# EAGLE design H_Power_feed (EAGLE 6.3)
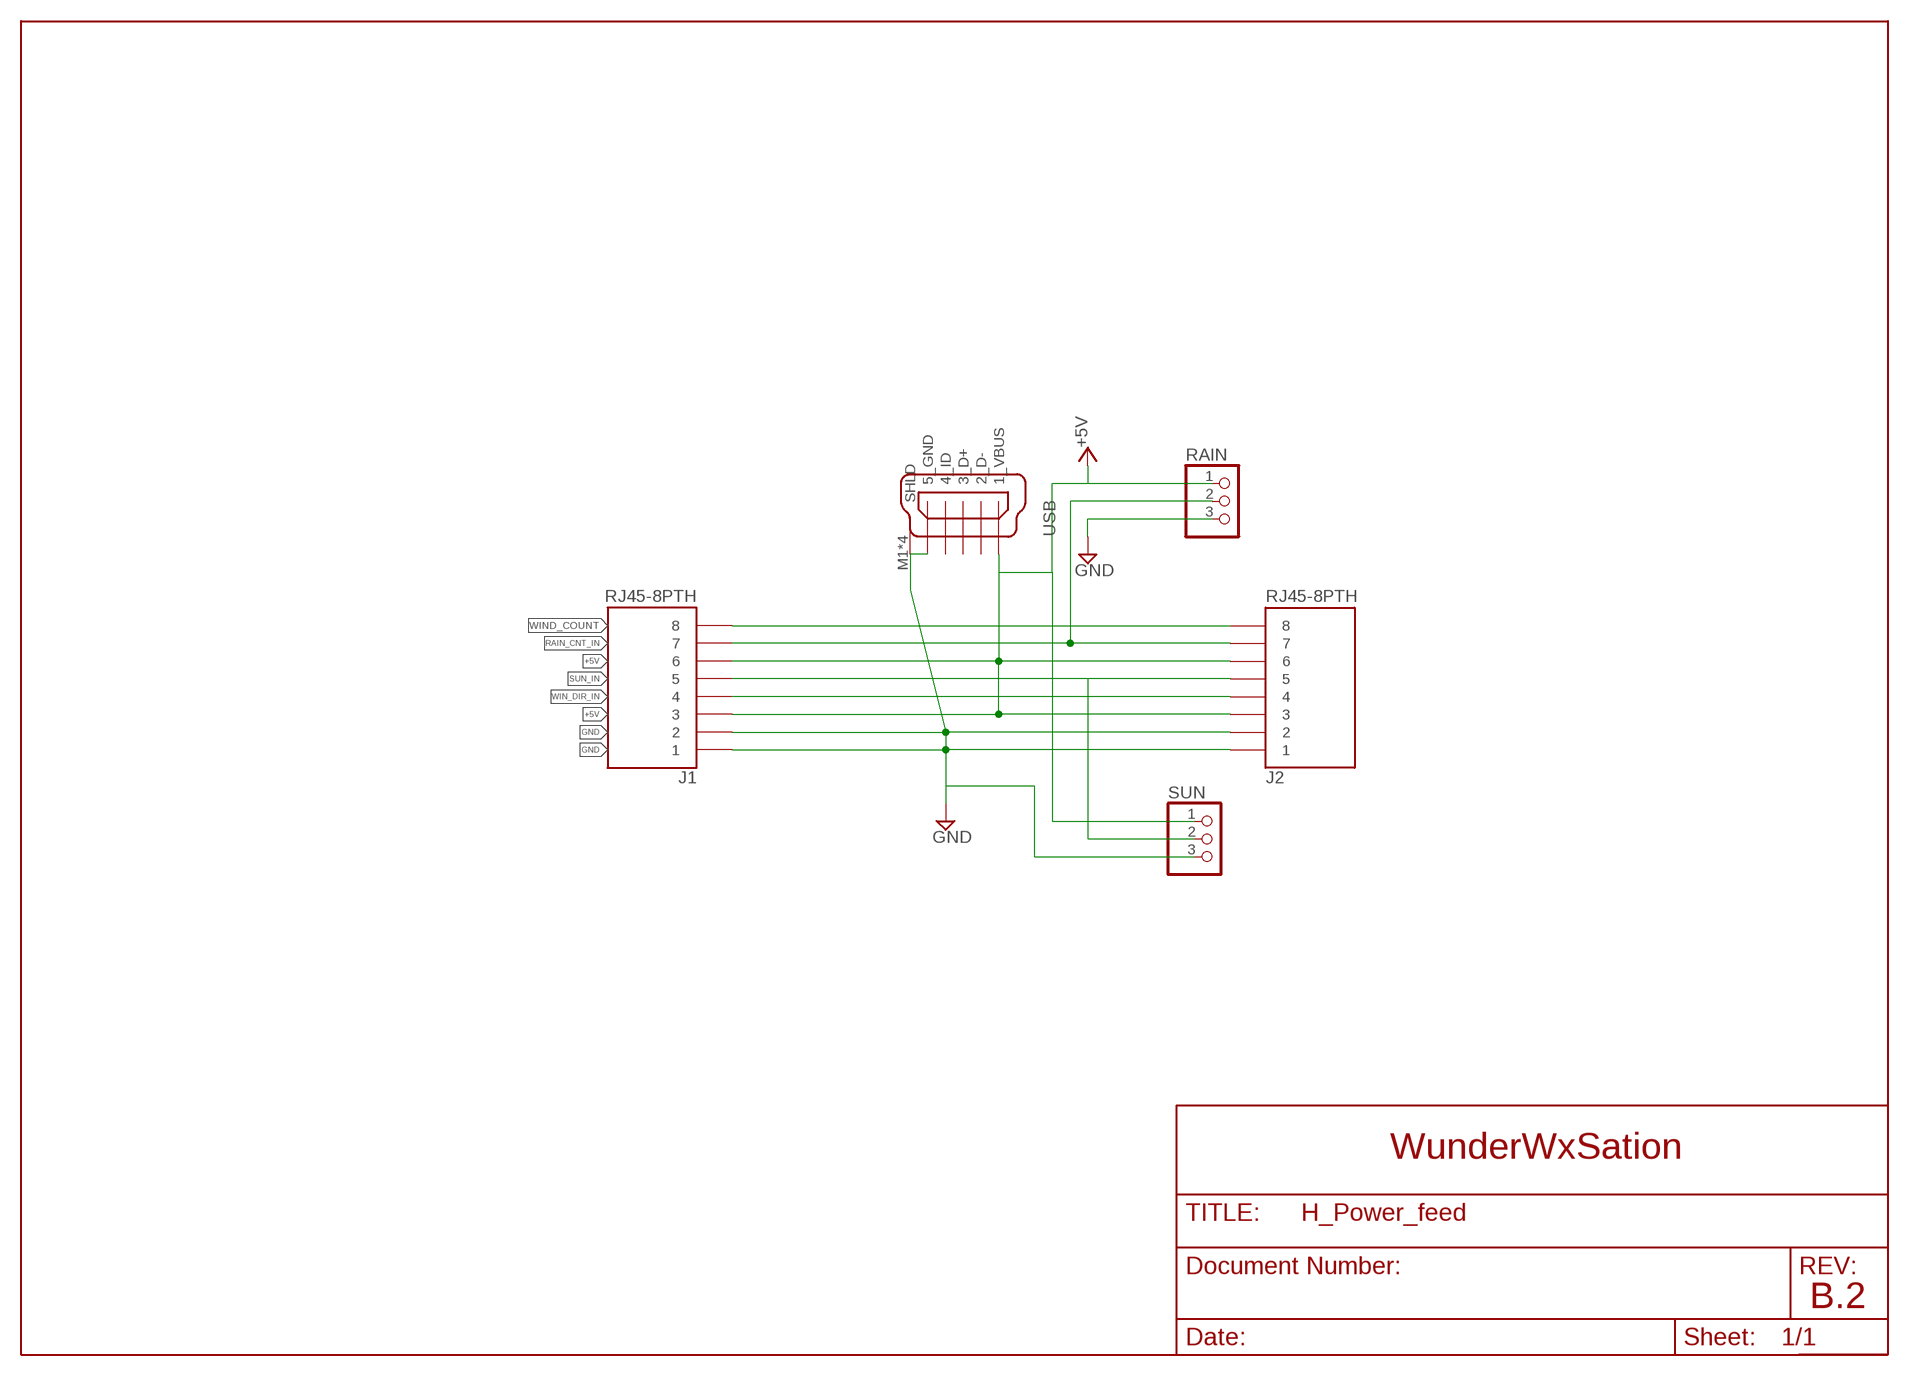
[diagram p0: schematic, sheet 1]

## Parts
J1  RJ45-8PTH  [RJ45-8]
J2  RJ45-8PTH  [RJ45-8]
RAIN  PINHD-1X3MOLEX_KK  [1X3_MOLEX_KK]
SUN  PINHD-1X3MOLEX_KK  [1X3_MOLEX_KK]
USB  MINI-USB-32005-301  [32005-301]

## Nets
+5V: J1.3 J1.6 J2.3 J2.6 RAIN.1 SUN.1 USB.1_VBUS
GND: J1.1 J1.2 J2.1 J2.2 RAIN.3 SUN.3 USB.5_USB_GND(5_GND) USB.M1(SHLD) USB.M2(SHLD) USB.M3(SHLD) USB.M4(SHLD)
RAIN_CNT_IN: J1.7 J2.7 RAIN.2
SUN_IN: J1.5 J2.5 SUN.2
WIN_DIR_IN: J1.4 J2.4
WIND_COUNT: J1.8 J2.8
Unconnected: USB.2_D- USB.3_D+ USB.4_ID

## Notes on the sheet
- WunderWxSation
- B.2

## Library data of the parts
J1 J2 = wifi_WX:RJ45-8: RJ45 Jack Simple RJ45, 8-pin connection - connector for common Cat5, Cat5e, and Cat6 Ethernet cables. Footprint not yet proven in production. Connector sku is PRT-00643; Breakout PCB sku is BOB-00716.
RAIN SUN = wifi_WX:PINHD-1X3: PIN HEADER
USB = wifi_WX:MINI-USB-: MINI USB-B Conector Source: www.cypressindustries.com

## Board
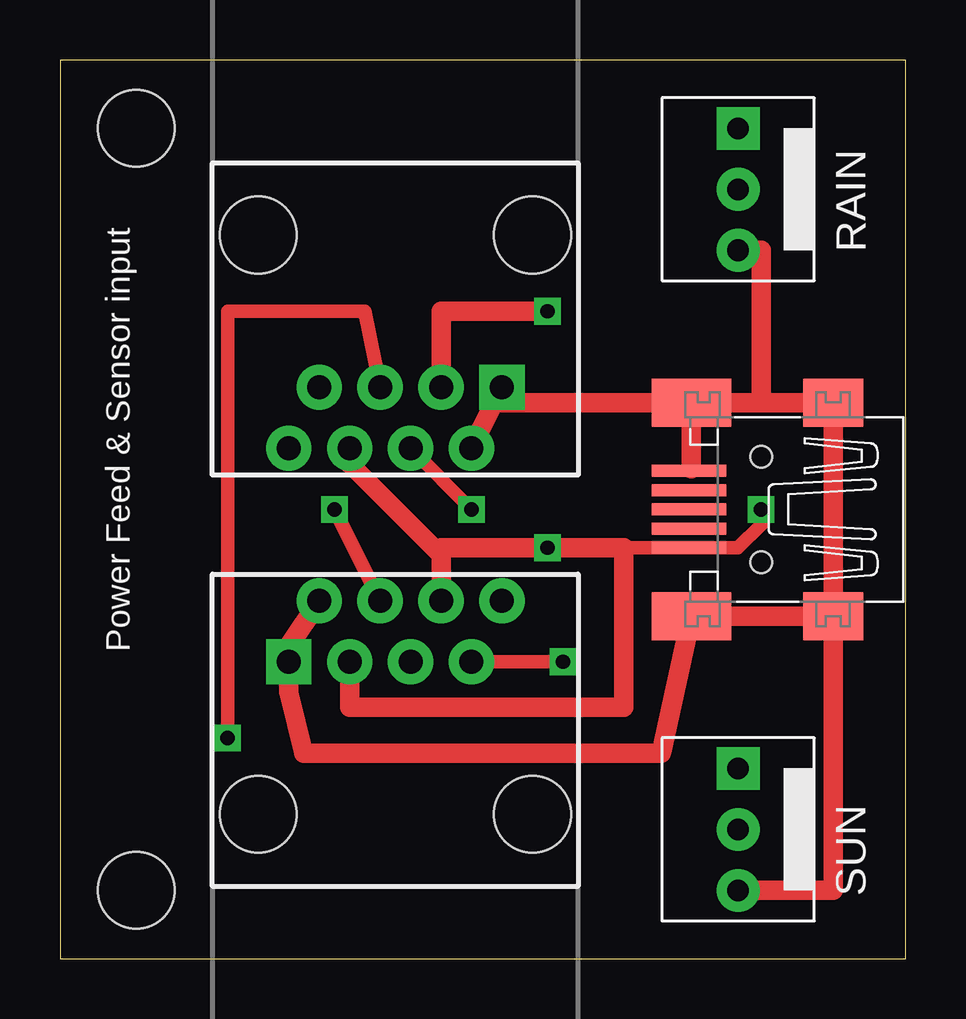
[diagram p1: board, top side]
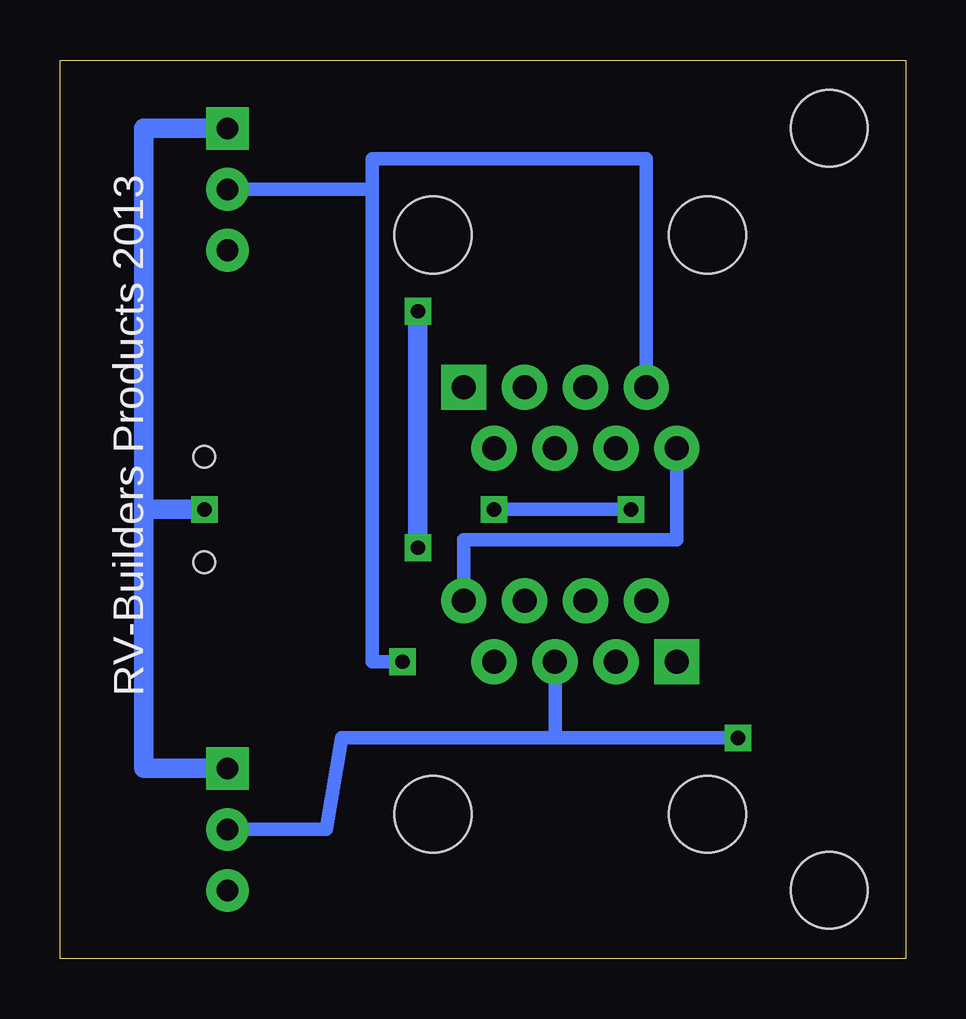
[diagram p2: board, bottom side, seen from below]

Size 35.23 x 37.45 mm. Coordinates in mm from the lower left corner, seen from the top.
Outline: 0,0 35.23,0 35.23,37.45 0,37.45 0,0
Copper layers (1*16): Top 0.035mm / dielectric 1.5mm / Bottom 0.035mm
Design rules "sparkfun": minimum track width 8mil, minimum drill 20mil, track to track 8mil, track to pad 8mil, pad to pad 8mil, via to via 8mil, smd to smd 8mil, copper to edge 10mil, drill to drill 8mil, minimum pad ring 12mil, minimum via ring 10mil, stop-mask expansion 4mil, vias tented up to drill 25mil, thermal gap 10mil
Holes 3.2 mm at 3.18,2.86 3.18,34.61

### Footprints (pad centres in the part's own frame; a part is rotated, then mirrored left to right if it is on the bottom)
RJ45-8 = drill 1 pad 1.88 square: 1 -4.445,6.35 | drill 1 pad 1.88: 2 -3.175,8.89; 3 -1.905,6.35; 4 -0.635,8.89; 5 0.635,6.35; 6 1.905,8.89; 7 3.175,6.35; 8 4.445,8.89 | hole 3.2: -5.715,0; 5.715,0
1X3_MOLEX_KK = drill 0.9 pad 1.778 square: 1 1.27,3.175 | drill 0.9 pad 1.778: 2 3.81,3.175; 3 6.35,3.175
32005-301 = smd 3.1 x 0.5: 1_VBUS 3,1.6; 2_D- 3,0.8; 3_D+ 3,0; 4_ID 3,-0.8; 5_USB_GND 3,-1.6 | smd 2.5 x 2: M1 -3,-4.45; M2 -3,4.45 | smd 3.3 x 2: M3 2.9,4.45; M4 2.9,-4.45 | hole 0.9: 0,2.2; 0,-2.2

### Placement (x,y rotation side)
J1  13.97,30.16 180 top
J2  13.97,6.03 0 top
RAIN  25.08,35.88 270 top
SUN  25.08,9.21 270 top
USB  29.21,18.73 180 top

### Tracks (layer width: path | path; a pad name or v marks a point on that pad's centre or on a via)
+5V  (via drill 0.6)
  Top 0.406: USB.1_VBUS 27.3,17.13 | 19.99,17.13 v20.32,17.13
  Top 0.559: v29.21,18.73 29.21,18.1 28.25,17.13 USB.1_VBUS 23.5,17.13
  Top 0.61: 15.87,17.13 15.87,16.83
  Top 0.813: 19.99,17.13 15.87,17.13 | J2.6 15.87,16.83 12.06,20.64 J1.6 | v20.32,17.13 23.5,17.13 23.5,10.48 12.06,10.48 J2.3 | J1.3 15.87,26.99 v20.32,26.99
  Bottom 0.813: v29.21,18.73 31.75,18.73 | 31.75,18.73 31.75,7.94 SUN.1 | RAIN.1 31.75,34.61 31.75,18.73 | v20.32,26.99 v20.32,17.13
GND
  Top 0.508: USB.5_USB_GND 26.31,20.43
  Top 0.61: J2.1 9.53,13.02
  Top 0.813: 29.21,23.18 USB.M1 USB.M2 | 29.21,23.18 USB.M4 | USB.M2 USB.M3 25.05,8.57 10.16,8.57 9.53,11.11 J2.1 | 26.31,20.43 USB.M4 | RAIN.3 29.21,29.53 29.21,23.18 | SUN.3 32.21,2.86 USB.M2 | USB.M4 18.42,23.18 J1.1 J1.2 | 9.53,13.02 J2.2
RAIN_CNT_IN  (via drill 0.6)
  Top 0.559: J2.7 v20.96,12.38
  Bottom 0.559: v20.96,12.38 22.23,12.38 22.23,32.07 | 22.23,32.07 22.23,33.34 10.79,33.34 J1.7 | RAIN.2 22.23,32.07
SUN_IN  (via drill 0.6)
  Top 0.559: J1.5 12.7,26.99 6.98,26.99 v6.98,9.21
  Bottom 0.559: v6.98,9.21 14.6,9.21 | 14.6,9.21 J2.5 | SUN.2 24.13,5.4 23.5,9.21 14.6,9.21
WIN_DIR_IN  (via drill 0.6)
  Top 0.559: v17.14,18.73 J1.4 | v11.43,18.73 J2.4
  Bottom 0.559: v11.43,18.73 v17.14,18.73
WIND_COUNT
  Bottom 0.559: J1.8 9.53,17.46 18.42,17.46 J2.8

### Text on the board
tPlace: Power Feed & Sensor input
bPlace: RV-Builders Products 2013